# EasyEDA Pro project 大功率LED驱动器.epro

# Schematic PT4121_5C670NL
Board Name: PT4121_5C670NL; Create Date: 2024-12-07; Page Name: P1; Project Name: 大功率LED驱动器; Schematic Name: PT4121_5C670NL; Update Date: 2025-01-06; Company: 嘉立创EDA; Page Size: A4; Version: V1.0
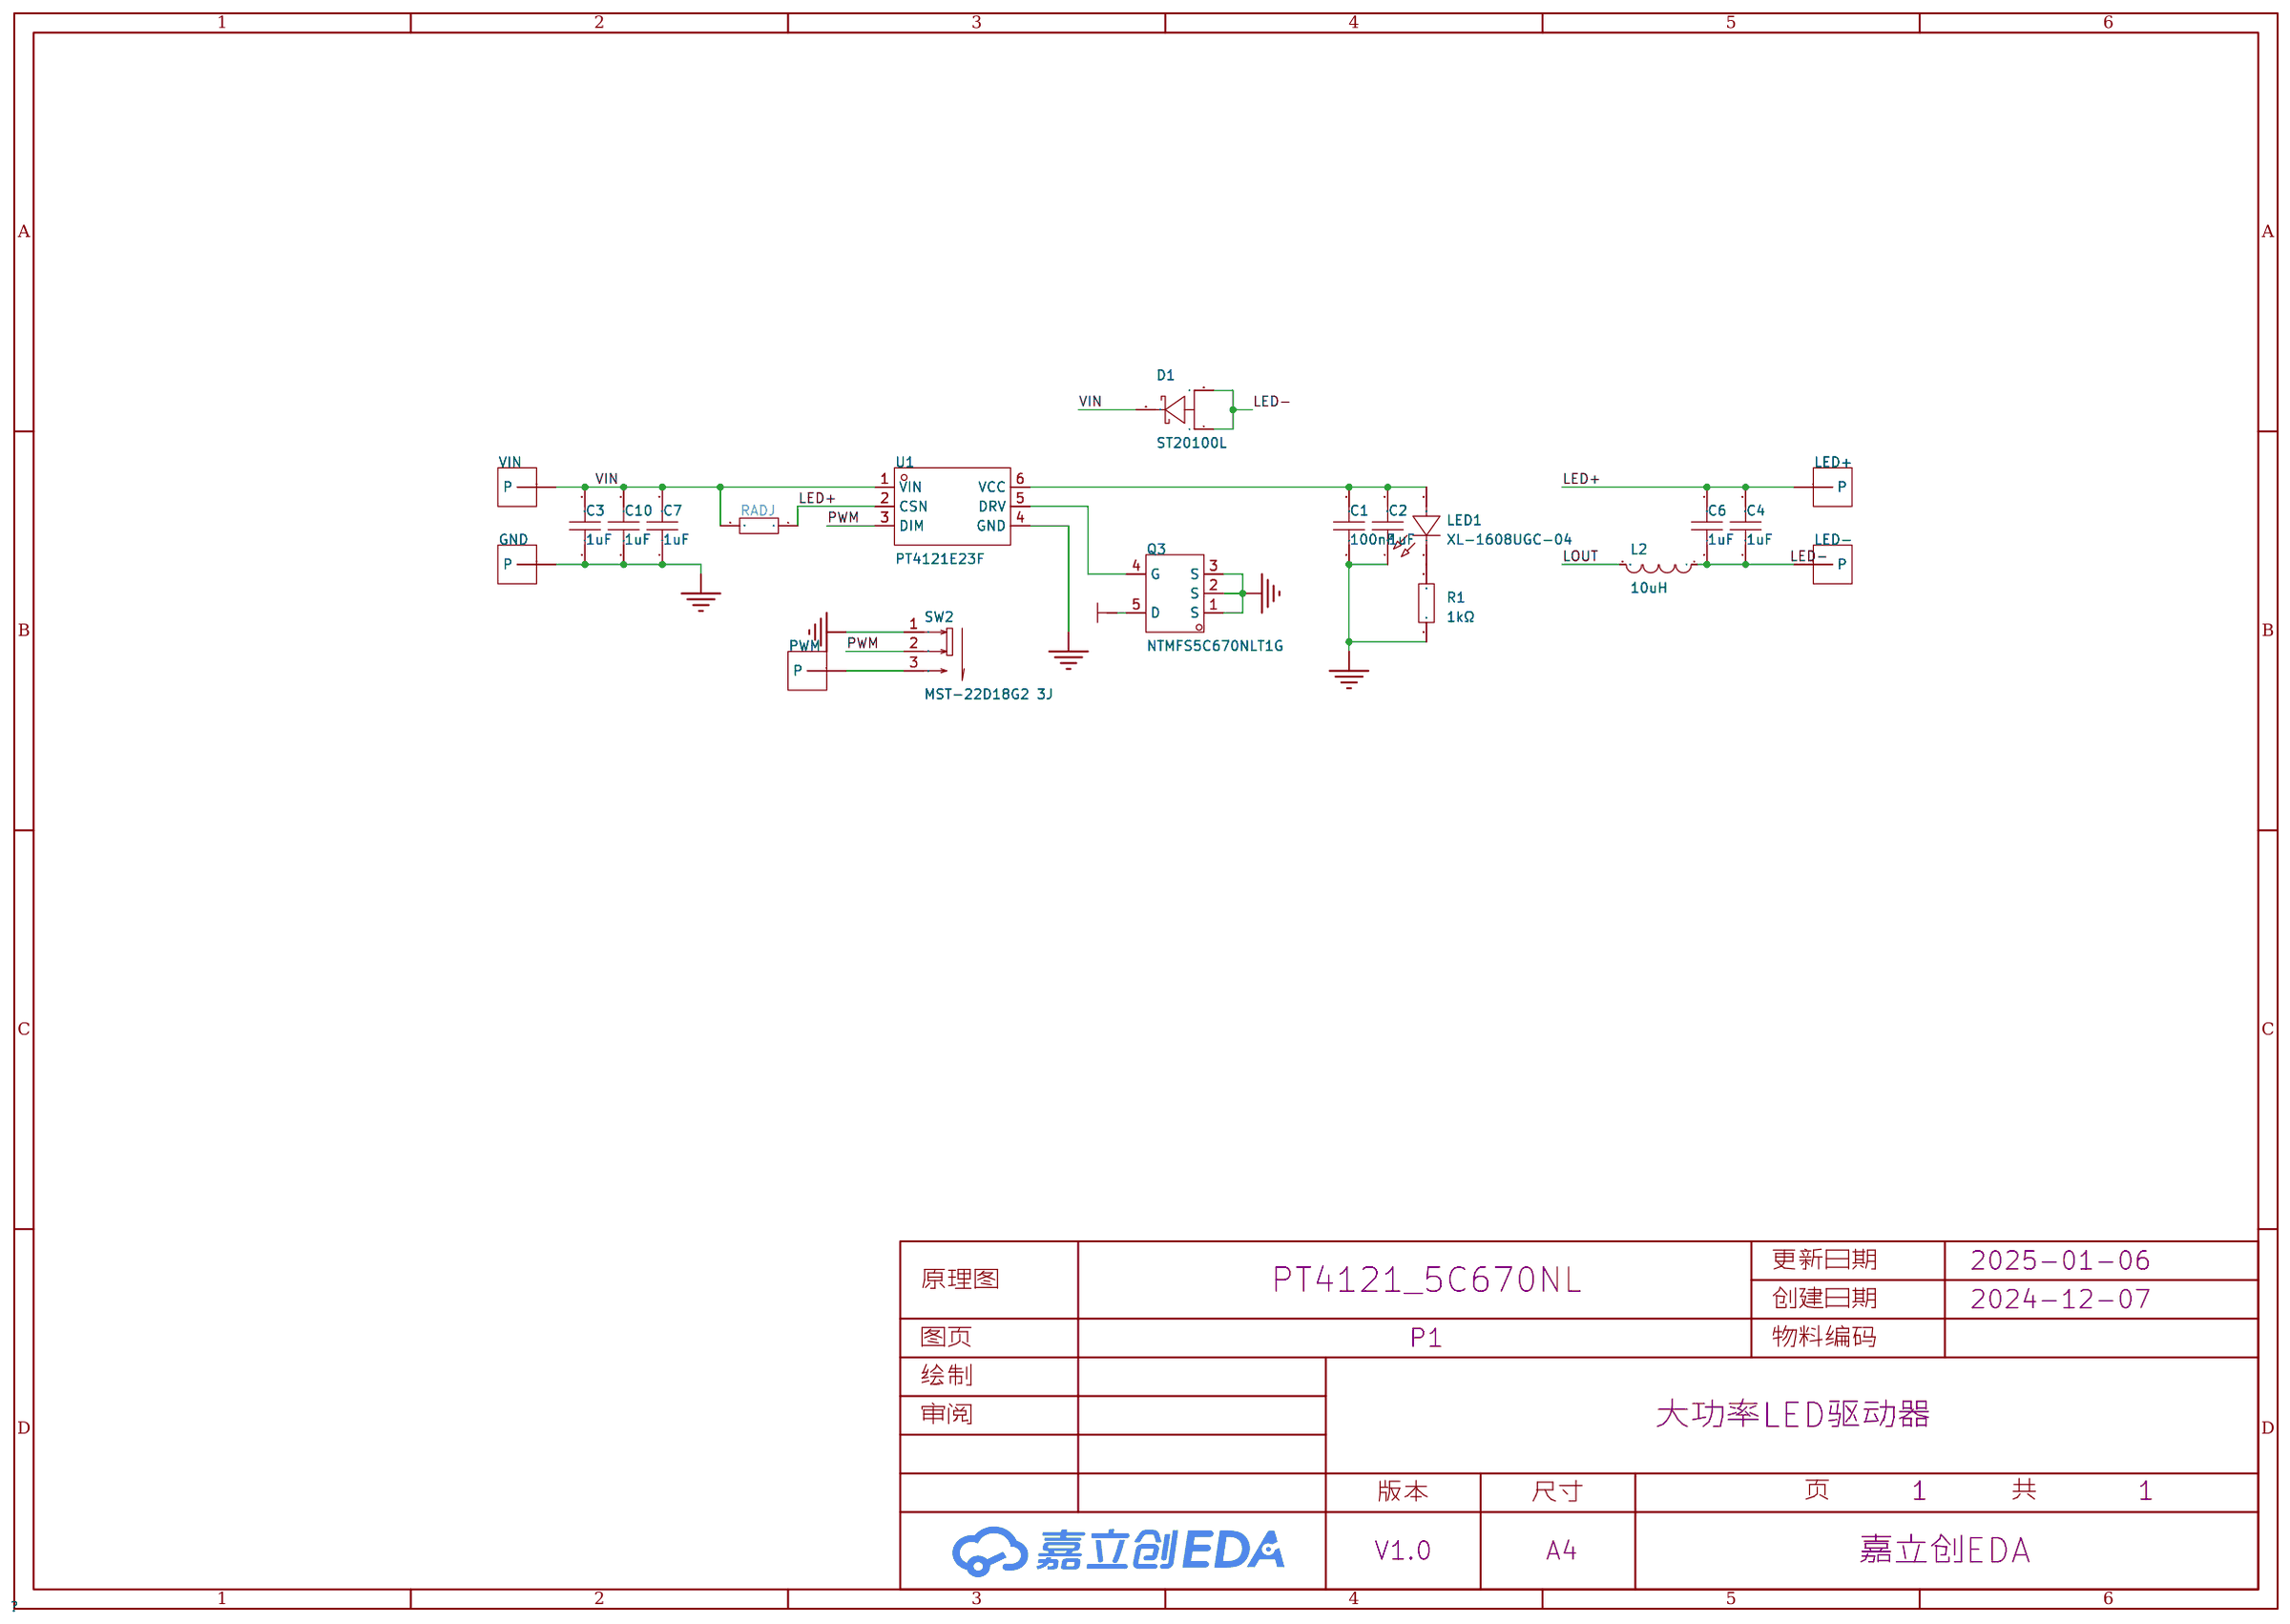
[diagram p0: schematic sheet]

## Parts
C1  100nF  [R0603]
C2  1uF  [R0603]
C3  1uF  [C0805]
C4  1uF  [C0805]
C6  1uF  [C0805]
C7  1uF  [C0805]
C10  1uF  [C0805]
D1  ST20100L  [TO-277_3P-L5.7-W4.2-LS6.5-BR]
GND  -  [焊盘1.6*2.2mm]  (no BOM)
L2  10uH  [IND-TH_L23.0-W12.0-P9.00-D1.3]
LED1  XL-1608UGC-04  [R0603]
LED+  -  [焊盘1.6*2.2mm]  (no BOM)
LED-  -  [焊盘1.6*2.2mm]  (no BOM)
PWM  -  [焊盘1.6*2.2mm]  (no BOM)
Q3  NTMFS5C670NLT1G  [DFN-5_L6.1-W5.1-P1.27-BL]
R1  1kΩ  [R0603]
RADJ  ADJMR  [RES-SMD_L6.4-W3.4]
SW2  MST-22D18G2 3J  [SW-SMD_SHOUHAN_MST-22D18G23J_C2875122]
U1  PT4121E23F  [SOT-23-6_L2.9-W1.6-P0.95-LS2.8-BR]
VIN  -  [焊盘1.6*2.2mm]  (no BOM)

## Library data of the parts
C1 C2 = CAP_0603: Supplier Footprint: 0603
C3 C4 C6 C7 C10 = CL21B105KBFNNNE: 容值:1uF;精度:±10%;额定电压:50V;材质(温度系数):X7R;; LCSC Part Name: 1uF ±10% 50V; Supplier Part: C28323; Manufacturer: SAMSUNG(三星); Supplier Footprint: 0805; JLCPCB Part Class: Basic Part; Datasheet: https://atta.szlcsc.com/upload/public/pdf/source/20160218/1457707763339.pdf; Supplier: LCSC; Tolerance: ±10%; Voltage Rated: 50V; Temperature Coefficient: X7R
D1 = ST20100L: 二极管配置:独立式;正向压降(Vf):650mV@20A;直流反向耐压(Vr):100V;整流电流:20A;; LCSC Part Name: 电压:100V 电流:20A; Supplier Part: C2693410; Manufacturer: CJ(江苏长电/长晶); Supplier Footprint: TO-277; JLCPCB Part Class: 扩展库; Datasheet: https://atta.szlcsc.com/upload/public/pdf/source/20210330/C2693410_9551F5ED840A67394421895091158B3C.pdf; Supplier: LCSC; Diode Configuration: 独立式; Forward Voltage (Vf@If): 650mV@20A; Reverse Voltage (Vr): 100V; Rectified Current: 20A; Reverse Leakage Current (Ir): 30uA@100V
GND LED+ LED- PWM VIN = 焊盘1.6x2.2: 焊盘：1.6mm*2.2mm
L2 = PDMTAT068125-100MLU: 电感值:10uH;精度:±20%;额定电流:18A;类型:磁环电感;; LCSC Part Name: 磁环电感 10uH ±20%; Supplier Part: C3011538; Manufacturer: PROD(谱罗德); Supplier Footprint: 插件,23x12mm; JLCPCB Part Class: 扩展库; Datasheet: https://atta.szlcsc.com/upload/public/pdf/source/20220512/C2D76F48AC99E22DC9ADDA10AFDA7CBC.pdf; Supplier: LCSC; Tolerance: ±20%; Rated Current: 18A; DC Resistance: 5mΩ; Type: 磁环电感; Ratings: AEC-Q200
LED1 = XL-1608UGC-04: 灯头类型:-;发光颜色:翠绿色;正向电压(VF):-;功率:80mW;正向电流:25mA;主波长:516nm~525nm;二极管配置:独立二极管;透镜颜色:无色透明透镜;色温:-;发光强度:-;发光角度:120°;载带方式:正贴;工作温度:-30℃~+85℃;; Supplier Part: C965804; Manufacturer: XINGLIGHT(成兴光); Supplier Footprint: 0603; JLCPCB Part Class: 扩展库; Datasheet: https://atta.szlcsc.com/upload/public/pdf/source/20221102/520D6E465E5CFD1609C8A4DBC80D4018.pdf; Supplier: LCSC; Emitted Color: 翠绿色; Power Dissipation: 80mW; Forward Current: 25mA; Dominant Wavelength: 516nm~525nm; Peak Wavelength: 534nm; Diode Configuration: 独立二极管; Lens Color: 无色透明透镜; Viewing Angle: 120°; Mounting Sytle: 正贴; Operating Temperature: -30℃~+85℃
Q3 = NTMFS5C670NLT1G: 类型:1个N沟道;漏源电压(Vdss):60V;连续漏极电流(Id):71A;导通电阻(RDS(on)@Vgs,Id):6.1mΩ@10V,35A;功率(Pd):61W;阈值电压(Vgs(th)@Id):2V@53uA;; LCSC Part Name: 1个N沟道 耐压:60V 电流:71A; Supplier Part: C179626; Manufacturer: onsemi(安森美); Supplier Footprint: DFN-5(5x6); JLCPCB Part Class: 扩展库; Datasheet: https://atta.szlcsc.com/upload/public/pdf/source/20221020/CBB579D21F9290D8F14D82B122325F26.pdf; Supplier: LCSC; Type: 1个N沟道; Drain Source Voltage (Vdss): 60V; Continuous Drain Current (Id): 71A; Drain Source On Resistance (RDS(on)@Vgs,Id): 6.1mΩ@10V,35A; Power Dissipation (Pd): 61W; Gate Threshold Voltage (Vgs(th)@Id): 2V@53uA; Total Gate Charge (Qg@Vgs): 20nC@10V; Input Capacitance (Ciss@Vds): 1.4nF@25V; Reverse Transfer Capacitance (Crss@Vds): 15pF@25V; Operating Temperature: -55℃~+175℃
R1 = RC0603FR-071KL: 电阻类型:厚膜电阻;阻值:1kΩ;精度:±1%;功率:100mW;最大工作电压:75V;温度系数:±100ppm/℃;; LCSC Part Name: 厚膜电阻 1kΩ ±1% 100mW; Supplier Part: C22548; Manufacturer: YAGEO(国巨); Supplier Footprint: 0603; JLCPCB Part Class: 扩展库; Datasheet: https://atta.szlcsc.com/upload/public/pdf/source/20180316/70C0E2BDAE7FCC62C531A5A58D202EE1.pdf; Supplier: LCSC; Type: 厚膜电阻; Tolerance: ±1%; Power(Watts): 100mW; Overload Voltage (Max): 75V; Temperature Coefficient: ±100ppm/℃; Operating Temperature Range: -55℃~+155℃
RADJ = EBWM2512F1L00S9: 电阻类型:采样电阻;阻值:1mΩ;精度:±1%;功率:6W;温度系数:±200ppm/℃;安装方式:贴片;; LCSC Part Name: 1mΩ ±1% 6W; Supplier Part: C5224158; Manufacturer: RESI(开步睿思); Supplier Footprint: 2512; JLCPCB Part Class: Extended Part; Datasheet: https://atta.szlcsc.com/upload/public/pdf/source/20231123/32E1A2B1C6B1C8175FF8915A40EC1366.pdf; Supplier: LCSC; Type: 采样电阻; Tolerance: ±1%; Power(Watts): 6W; Temperature Coefficient: ±200ppm/℃; Mounting Sytle: 贴片
SW2 = MST-22D18G2 3J: 电路结构:单刀双掷;安装方式:立贴;开关颜色:-;额定电流(DC):50mA;额定电压(DC):12V;额定电流(AC):-;额定电压(AC):-;机械寿命:1万次;; LCSC Part Name: 拨动开关 2档3脚立式贴片 柄高2MM 9.1*3.5*2.0mm; Supplier Part: C2875122; Manufacturer: SHOU HAN(首韩); Supplier Footprint: SMD; JLCPCB Part Class: 扩展库; Supplier: LCSC; Circuit: 单刀双掷; Pin Style: SMD接片; Switch Length: 9.1mm; Switch Width: 3.6mm; Switch Height: 3.45mm; Mounting Style: 立贴; Current Rating (DC): 50mA; Voltage Rating (DC): 12V; Mechanical Life: 1万次; Operating Temperature: -30℃~+80℃
U1 = PT4121E23F: Supplier Part: C89775; Manufacturer: PowTech(华润矽威); Supplier Footprint: SOT-23-6; JLCPCB Part Class: 扩展库; Datasheet: https://atta.szlcsc.com/upload/public/pdf/source/20180326/C89775_D0E1014B7A1574597EA3FB2749903689.pdf; Supplier: LCSC

## Nets
GND: C1.1 C2.1 C3.1 C7.1 C10.1 GND.1(P) Q3.1(S) Q3.2(S) Q3.3(S) R1.1 SW2.1 U1.4(GND)
VIN: C3.2 C7.2 C10.2 D1.2(K) RADJ.2 U1.1(VIN) VIN.1(P)
LED+: C4.2 C6.2 LED+.1(P) RADJ.1 U1.2(CSN)
LED-: C4.1 C6.1 D1.1(A) D1.3(A) L2.1 LED-.1(P)
LOUT: L2.2 Q3.5(D)
PWM: SW2.2 U1.3(DIM)
$1N195: C1.2 C2.2 LED1.2(A) U1.6(VCC)
$1N3239: LED1.1(K) R1.2
$1N4928: Q3.4(G) U1.5(DRV)
$1N4979: PWM.1(P) SW2.3

# Board PT4121_5C670NL
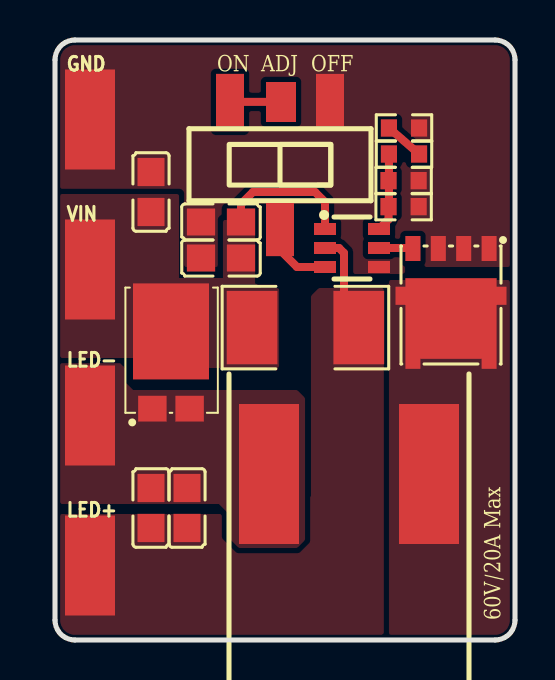
[diagram p1: board, top side]
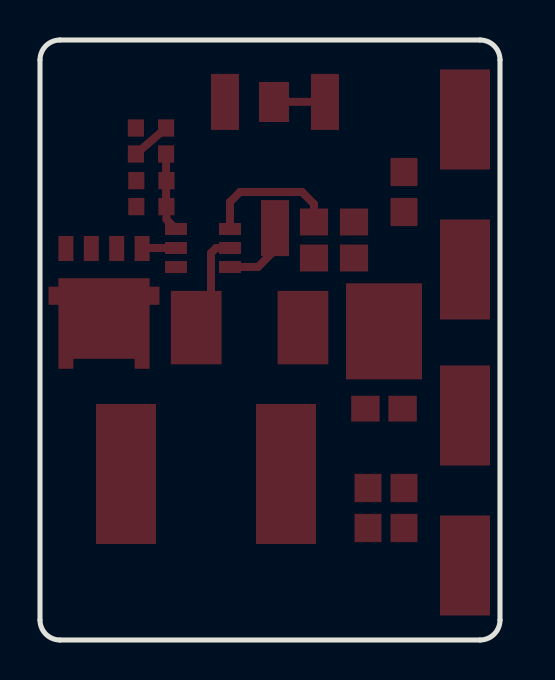
[diagram p2: board, bottom side, seen from below]

Outline 23 x 30 mm; copper layers: Top Layer, Bottom Layer. Coordinates in mm from the lower left corner of the outline.
Outline path: 0,29 0,1 arc(0.29,0.29) 1,0 22,0 arc(22.71,0.29) 23,1 23,29 arc(22.71,29.71) 22,30 1,30 arc(0.29,29.71) 0,29
Stack: Top Layer 0.035mm / Dielectric1 1.51mm FR4 er 4.5 / Bottom Layer 0.035mm

## Design rules (mm)
template: 自定义配置
spacing copperThickness1oz (default): track to track 0.102, other pairs 0.152 to 0.3
spacing copperThickness2oz: track to track 0.203, other pairs 0.152 to 0.3
track width copperThickness1oz (default): min 0.127, default 0.4, max 2.54
track width copperThickness2oz: min 0.203, default 0.254, max 2.54
differential pair differentialPair (default): width min 0.127, default 0.254, max 2.54; gap min 0.152, default 0.152
via viaSize (default): diameter min 0.5, default 0.61, max 10; hole min 0.3, default 0.305, max 6.3

## Placement (name value [footprint] x y rotation side)
C1  100nF  [R0603]  17.43 21.67 180 top
C2  1uF  [R0603]  17.43 22.97 180 top
C3  1uF  [C0805]  8.3 19.1 0 top
C4  1uF  [C0805]  4.8 6.6 270 top
C6  1uF  [C0805]  6.6 6.6 270 top
C7  1uF  [C0805]  8.3 20.9 0 top
C10  1uF  [C0805]  4.8 22.4 270 top
D1  ST20100L  [TO-277_3P-L5.7-W4.2-LS6.5-BR]  5.8 13.5 270 top
GND  -  [焊盘1.6*2.2mm]  0.65 26.83 270 top
L2  10uH  [IND-TH_L23.0-W12.0-P9.00-D1.3]  14.7 8.3 90 top
LED1  XL-1608UGC-04  [R0603]  17.45 24.3 180 top
LED+  -  [焊盘1.6*2.2mm]  0.65 4.53 270 top
LED-  -  [焊盘1.6*2.2mm]  0.65 12.03 270 top
PWM  -  [焊盘1.6*2.2mm#2]  10.5 25.8 0 top
Q3  NTMFS5C670NLT1G  [DFN-5_L6.1-W5.1-P1.27-BL]  19.8 17.7 180 top
R1  1kΩ  [R0603]  17.45 25.6 180 top
RADJ  ADJMR  [RES-SMD_L6.4-W3.4]  12.52 15.62 180 top
SW2  MST-22D18G2 3J  [SW-SMD_SHOUHAN_MST-22D18G23J_C2875122]  11.25 23.75 180 top
U1  PT4121E23F  [SOT-23-6_L2.9-W1.6-P0.95-LS2.8-BR]  14.85 19.6 180 top
VIN  -  [焊盘1.6*2.2mm]  0.65 19.33 270 top

## Footprints (pads in the part's own frame, mm; a bottom-side part is the same pattern mirrored in y, then rotated)
C0805
  rect 1.41x1.35 smd: 1(-1,0) 2(1,0)
DFN-5_L6.1-W5.1-P1.27-BL
  rect 0.75x1.25 smd: 1(-1.905,-1.875) 2(-0.635,-1.875) 3(0.635,-1.875) 4(1.905,-1.875)
  custom 5.55x4.53 smd: 5(0,1.875)
IND-TH_L23.0-W12.0-P9.00-D1.3
  custom 7x3 smd: 1(0,4) 2(0,-4)
R0603
  rect 0.806x0.864 smd: 1(-0.753,0) 2(0.753,0)
RES-SMD_L6.4-W3.4
  rect 2.535x3.672 smd: 1(-2.667,0) 2(2.667,0)
SOT-23-6_L2.9-W1.6-P0.95-LS2.8-BR
  rect 1.1x0.6 smd: 1(1.35,-0.95) 2(1.35,0) 3(1.35,0.95) 4(-1.35,0.95) 5(-1.35,0) 6(-1.35,-0.95)
SW-SMD_SHOUHAN_MST-22D18G23J_C2875122
  rect 1.4x2.8 smd: 1(-2.5,-3.155) 2(0,3.155) 3(2.5,-3.155)
TO-277_3P-L5.7-W4.2-LS6.5-BR
  rect 1.29x1.423 smd: 1(1.933,-0.93) 3(1.933,0.93)
  rect 4.8x3.8 smd: 2(-1.933,0)
焊盘1.6*2.2mm
  rect 5x2.5 smd: 1(0.8,1.1)
焊盘1.6*2.2mm#2
  rect 1.5x2 smd: 1(0.8,1.1)

## Nets
As in the schematic.

## Routing (per net, layer and track width the routed paths; a pad name or vN(x,y) marks a point on that pad's centre or on a via; arc(x,y) is an arc through that point)
VIN: length 6.9
  Top Layer w0.4: U1.1 13.5,21.9 13,22.4 9.9,22.4 9.3,21.8 C7.2
LED+: length 5.1
  Top Layer w0.4: RADJ.1 14.45,16.36 14.45,19.35 14.2,19.6 U1.2
PWM: length 3.2
  Top Layer w0.4: U1.3 12.1,18.65 11.25,19.5 11.25,20.09
$1N195: length 4
  Top Layer w0.4: U1.6 16.68,21.03 C1.2 16.7,21.69 LED1.2
$1N3239: length 2
  Top Layer w0.4: R1.2 LED1.1
$1N4928: length 1.7
  Top Layer w0.4: U1.5 17.87,19.6 Q3.4
$1N4979: length 2.6
  Top Layer w0.4: PWM.1 11.29,26.91 SW2.3

## Copper pours and planes (outline as drawn; the poured copper is in the pictures)
GND on Top Layer: 14.9,18.3 14.9,18.65 0,18.65 0,30 23,30 23,18.65 17.5,18.65 17.5,18.3
VIN on Top Layer: 8.4,18.1 8.4,21 10,21 10,17.84 10.3,17.6 11.2,17.6 11.2,13.6 7.7,13.6 7.2,14.1 0,14.1 0,22.3 6.2,22.3 6.2,18.1
LED+ on Top Layer: 0,6.3 11.9,6.3 12.8,7.2 12.8,17.2 13.2,17.6 16.6,17.6 16.6,0.5 16.1,0 0,0
LED- on Top Layer: 8.6,6.4 8.2,6.8 0,6.8 0,14.1 3,14.1 3.5,13.6 3.5,12.9 3.9,12.5 12.1,12.5 12.5,12.1 12.5,5 12.1,4.6 9.2,4.6 8.6,5.2
LOUT on Top Layer: 16.7,18 16.7,0 23,0 23,18.1 22.9,18

## Text on the board
Document Layer: 调整采样电阻以调整输出电流 / 电流计算公式：I=0.2/Rs / 驱动多个LED时，串联以减少发热
Top Solder Mask Layer: V0.2 | Designed by / Urmouky
Top Silkscreen Layer: ON | ADJ | OFF | 60V/20A Max
